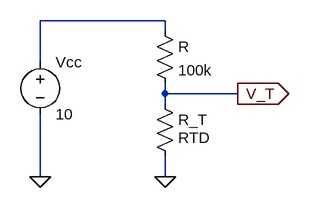
[diagram p0: schematic circuito_div_tension.asc]
circuito_div_tension.asc, the LTspice schematic file:
Version 4
SHEET 1 880 680
WIRE 112 32 -80 32
WIRE 112 48 112 32
WIRE -80 96 -80 32
WIRE 112 144 112 128
WIRE 224 144 112 144
WIRE 112 160 112 144
WIRE -80 272 -80 176
WIRE 112 272 112 240
FLAG 112 272 0
FLAG -80 272 0
FLAG 224 144 V_T
IOPIN 224 144 Out
SYMBOL res 96 32 R0
SYMATTR InstName R
SYMATTR Value 100k
SYMBOL res 96 144 R0
WINDOW 3 36 68 Left 2
SYMATTR Value RTD
SYMATTR InstName R_T
SYMBOL voltage -80 80 R0
WINDOW 123 0 0 Left 0
WINDOW 39 0 0 Left 0
SYMATTR InstName Vcc
SYMATTR Value 10

The netlist it stands for:
* circuito_div_tension.asc
R N001 V_T 100k
R_T V_T 0 RTD
Vcc N001 0 10
.backanno
.end